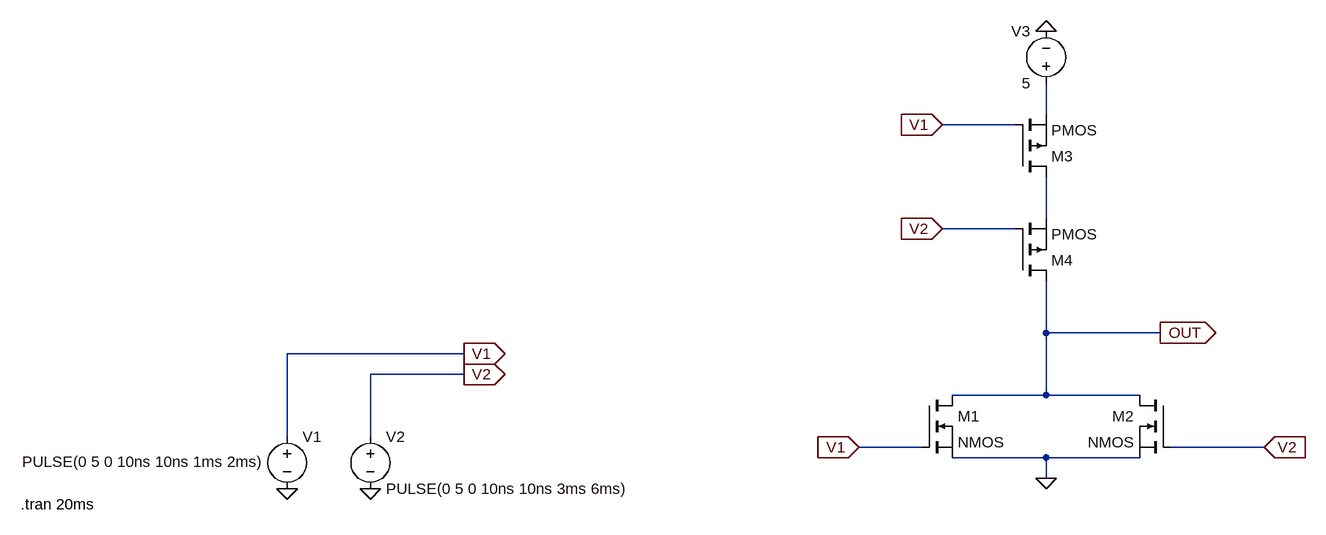
[diagram p0: schematic NOR_gate.asc]
NOR_gate.asc, the LTspice schematic file:
Version 4
SHEET 1 1464 680
WIRE 1040 -304 1040 -352
WIRE 992 -288 880 -288
WIRE 1040 -144 1040 -208
WIRE 992 -128 880 -128
WIRE 1040 32 1040 -48
WIRE 1216 32 1040 32
WIRE 144 64 -128 64
WIRE 144 96 0 96
WIRE 1040 128 1040 32
WIRE 1040 128 896 128
WIRE 1184 128 1040 128
WIRE -128 192 -128 64
WIRE 0 192 0 96
WIRE 848 208 752 208
WIRE 1376 208 1232 208
WIRE 1040 224 896 224
WIRE 1184 224 1040 224
WIRE 1040 256 1040 224
FLAG -128 272 0
FLAG 0 272 0
FLAG 144 64 V1
IOPIN 144 64 Out
FLAG 144 96 V2
IOPIN 144 96 Out
FLAG 1040 256 0
FLAG 1040 -432 0
FLAG 880 -288 V1
IOPIN 880 -288 In
FLAG 880 -128 V2
IOPIN 880 -128 In
FLAG 1376 208 V2
IOPIN 1376 208 In
FLAG 752 208 V1
IOPIN 752 208 In
FLAG 1216 32 OUT
IOPIN 1216 32 Out
SYMBOL voltage -128 176 R0
WINDOW 3 -408 54 Left 2
WINDOW 123 0 0 Left 0
WINDOW 39 0 0 Left 0
SYMATTR InstName V1
SYMATTR Value PULSE(0 5 0 10ns 10ns 1ms 2ms)
SYMBOL voltage 0 176 R0
WINDOW 123 0 0 Left 0
WINDOW 39 0 0 Left 0
SYMATTR InstName V2
SYMATTR Value PULSE(0 5 0 10ns 10ns 3ms 6ms)
SYMBOL nmos 848 128 R0
SYMATTR InstName M1
SYMBOL nmos 1232 128 M0
SYMATTR InstName M2
SYMBOL pmos 992 -208 M180
SYMATTR InstName M3
SYMBOL pmos 992 -48 M180
SYMATTR InstName M4
SYMBOL voltage 1040 -336 R180
WINDOW 0 24 96 Left 2
WINDOW 3 24 16 Left 2
WINDOW 123 0 0 Left 0
WINDOW 39 0 0 Left 0
SYMATTR InstName V3
SYMATTR Value 5
TEXT -538 296 Left 2 !.tran 20ms

The netlist it stands for:
* NOR_gate.asc
V1 V1 0 PULSE(0 5 0 10ns 10ns 1ms 2ms)
V2 V2 0 PULSE(0 5 0 10ns 10ns 3ms 6ms)
M1 OUT V1 0 0 NMOS
M2 OUT V2 0 0 NMOS
M3 N002 V1 N001 N001 PMOS
M4 OUT V2 N002 N002 PMOS
V3 N001 0 5
.model NMOS NMOS
.model PMOS PMOS
.lib standard.mos
.tran 20ms
.backanno
.end